# EAGLE design Klimasensor (EAGLE 7.3.0)
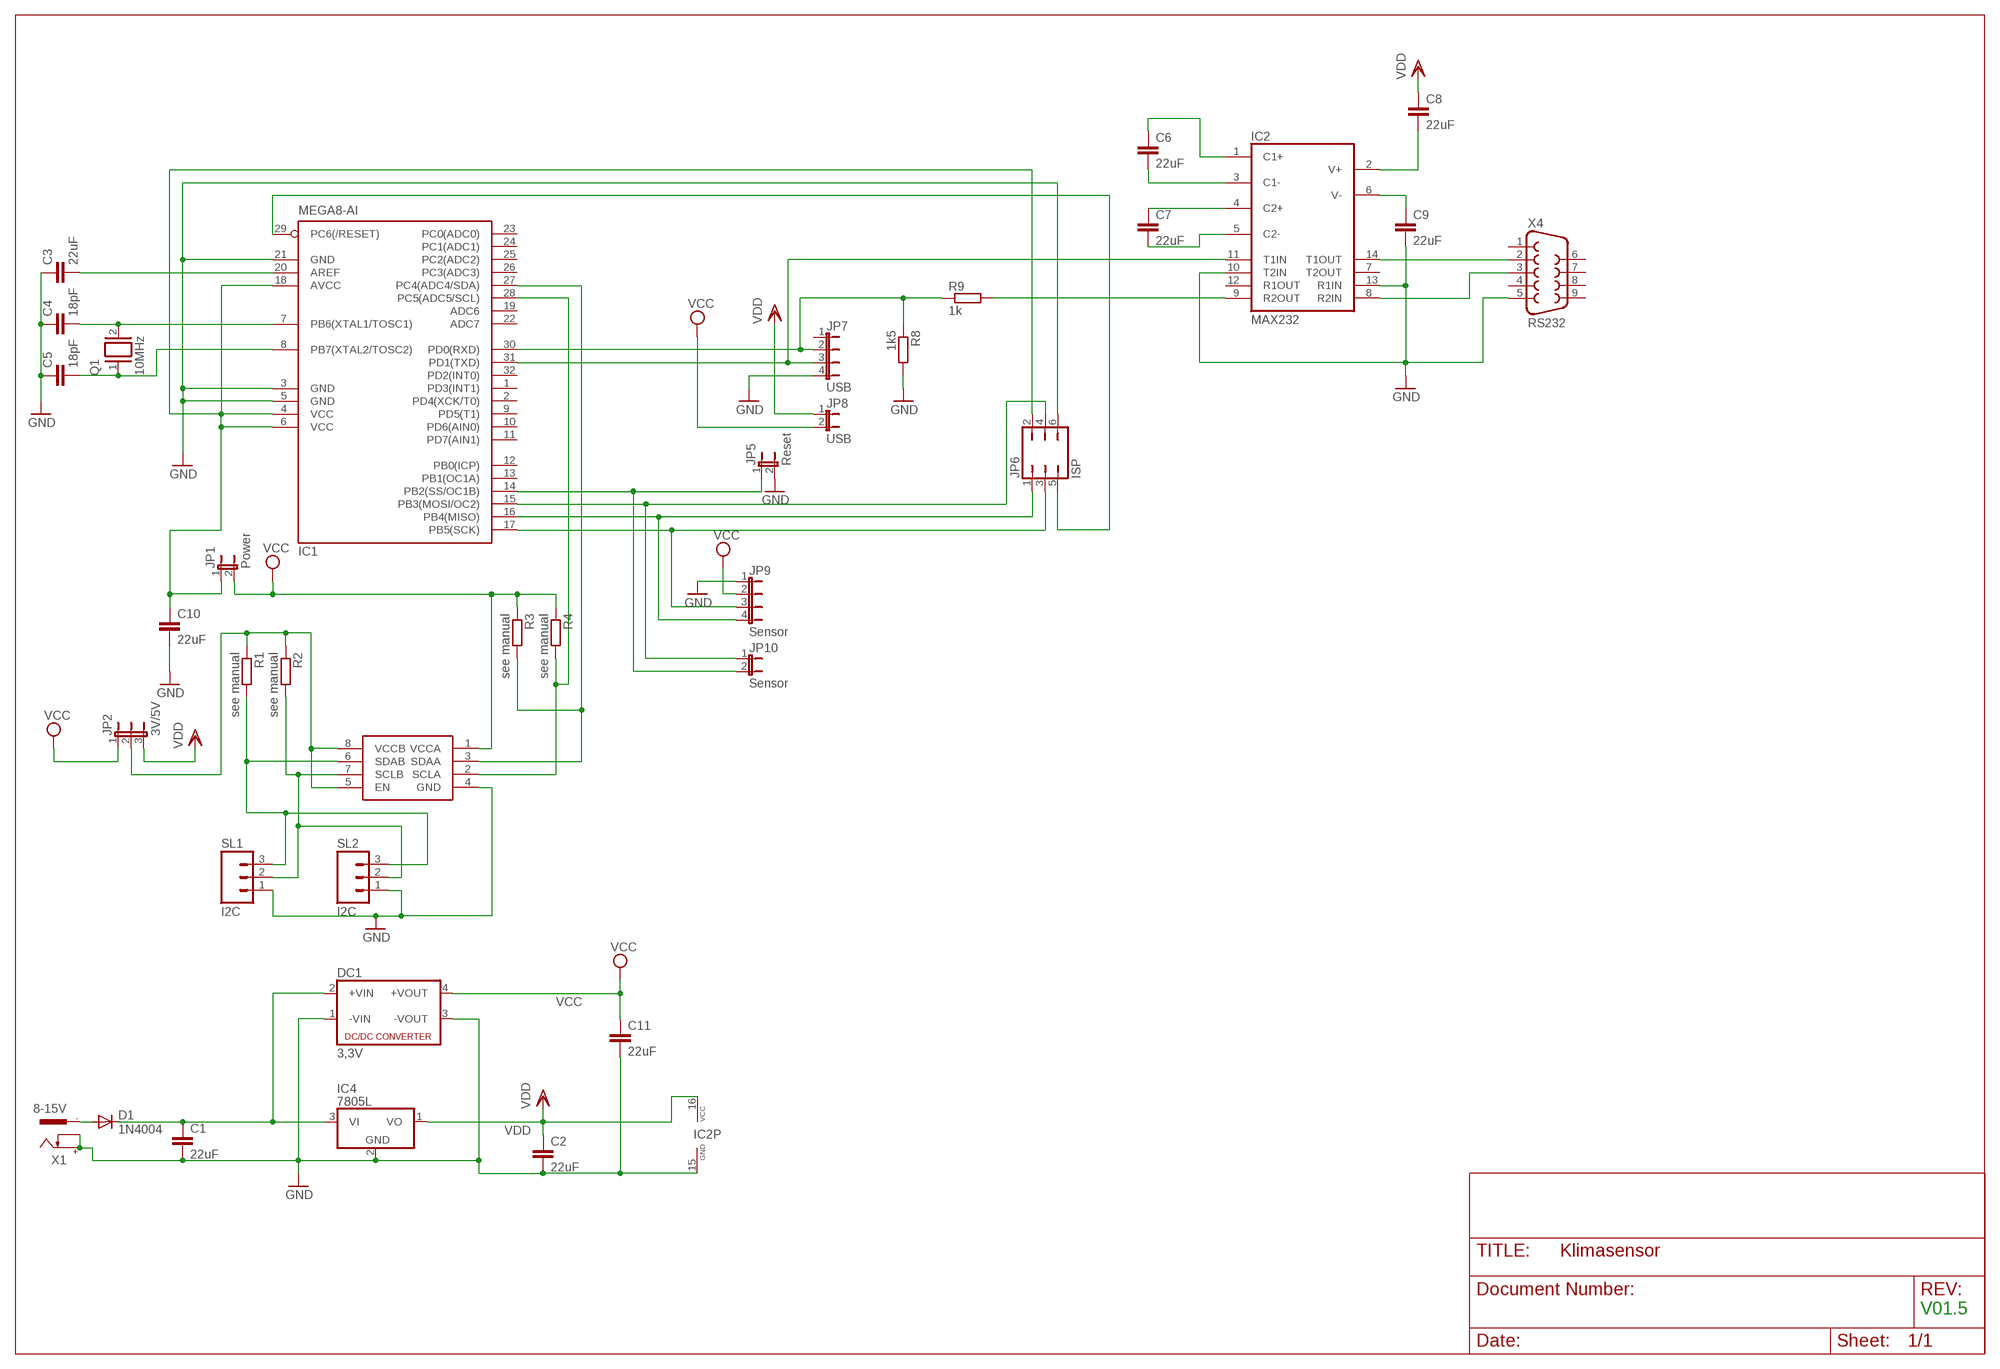
[diagram p0: schematic, sheet 1]

## Parts
C1  22uF  C-EUC1206  [C1206]
C2  22uF  C-EUC1206  [C1206]
C3  22uF  C-EUC1206  [C1206]
C4  18pF  C-EU025-025X050  [C025-025X050]
C5  18pF  C-EU025-025X050  [C025-025X050]
C6  22uF  C-EUC1206  [C1206]
C7  22uF  C-EUC1206  [C1206]
C8  22uF  C-EUC1206  [C1206]
C9  22uF  C-EUC1206  [C1206]
C10  22uF  C-EUC1206  [C1206]
C11  22uF  C-EUC1206  [C1206]
D1  1N4004  [DO41-10]
DC1  3,3V  NME  [NME]
IC1  MEGA8-AI  [TQFP32-08]
IC2  MAX232  [DIL16]
IC3  PCA9517  [SO-08]
IC4  7805L  [TO92]
JP1  Power  JP1E  [JP1]
JP2  3V/5V  JP2E  [JP2]
JP5  Reset  JP1E  [JP1]
JP6  ISP  JP3Q  [JP3Q]
JP7  USB  JP4E  [JP4]
JP8  USB  JP1E  [JP1]
JP9  Sensor  JP4E  [JP4]
JP10  Sensor  JP1E  [JP1]
Q1  10MHz  XTAL/S  [QS]
R1  see manual  R-EU_R1206  [R1206]
R2  see manual  R-EU_R1206  [R1206]
R3  see manual  R-EU_R1206  [R1206]
R4  see manual  R-EU_R1206  [R1206]
R8  1k5  R-EU_R1206  [R1206]
R9  1k  R-EU_R1206  [R1206]
SL1  I2C  M03  [03P]
SL2  I2C  M03  [03P]
X1  8-15V  737992-55  [737992-5]
X4  RS232  F09H  [F09H]

## Nets
GND: C1.2 C2.2 C3.1 C4.1 C5.1 C9.2 C10.2 C11.2 DC1.1(-VIN) DC1.3(-VOUT) IC1.3(GND) IC1.5(GND) IC1.21(GND) IC2.10(T2IN) IC2.13(R1IN) IC2.15(GND) IC3.4(GND) IC4.2(GND) JP5.2 JP6.6 JP7.4 JP9.1 R8.2 SL1.1 SL2.1 X1.+ X1.K X4.5
N$1: IC3.6(SDAB) R1.2 SL1.3 SL2.3
N$2: IC1.15(PB3(MOSI/OC2)) JP6.4 JP10.1
N$3: C1.1 D1.C DC1.2(+VIN) IC4.3(VI)
N$5: IC1.27(PC4(ADC4/SDA)) IC3.3(SDAA) R3.2
N$6: IC3.5(EN) IC3.8(VCCB) JP2.2 R1.1 R2.1
N$7: IC1.28(PC5(ADC5/SCL)) IC3.2(SCLA) R4.2
N$8: IC1.17(PB5(SCK)) JP6.3 JP9.3
N$10: IC1.31(PD1(TXD)) IC2.11(T1IN) JP7.3
N$11: IC1.14(PB2(SS/OC1B)) JP5.1 JP10.2
N$12: IC2.8(R2IN) X4.3
N$13: C3.2 IC1.20(AREF)
N$14: IC2.14(T1OUT) X4.2
N$15: IC1.16(PB4(MISO)) JP6.1 JP9.4
N$16: C8.2 IC2.2(V+)
N$17: C6.1 IC2.1(C1+)
N$18: IC1.29(PC6(/RESET)) JP6.5
N$19: C4.2 IC1.7(PB6(XTAL1/TOSC1)) Q1.2
N$20: C6.2 IC2.3(C1-)
N$21: C7.2 IC2.5(C2-)
N$22: IC3.7(SCLB) R2.2 SL1.2 SL2.2
N$23: C7.1 IC2.4(C2+)
N$24: C9.1 IC2.6(V-)
N$25: IC2.9(R2OUT) R9.2
N$26: C10.1 IC1.4(VCC) IC1.6(VCC) IC1.18(AVCC) JP1.1 JP6.2
N$27: D1.A X1.-1
N$28: IC1.30(PD0(RXD)) JP7.2 R8.1 R9.1
N$37: C5.2 IC1.8(PB7(XTAL2/TOSC2)) Q1.1
VCC: C11.1 DC1.4(+VOUT) IC3.1(VCCA) JP1.2 JP2.1 JP8.2 JP9.2 R3.1 R4.1
VDD: C2.1 C8.1 IC2.16(VCC) IC4.1(VO) JP2.3 JP8.1
Unconnected: IC1.1(PD3(INT1)) IC1.2(PD4(XCK/T0)) IC1.9(PD5(T1)) IC1.10(PD6(AIN0)) IC1.11(PD7(AIN1)) IC1.12(PB0(ICP)) IC1.13(PB1(OC1A)) IC1.19(ADC6) IC1.22(ADC7) IC1.23(PC0(ADC0)) IC1.24(PC1(ADC1)) IC1.25(PC2(ADC2)) IC1.26(PC3(ADC3)) IC1.32(PD2(INT0)) IC2.7(T2OUT) IC2.12(R1OUT) JP7.1 X1.-2 X4.1 X4.4 X4.6 X4.7 X4.8 X4.9

## Notes on the sheet
- V01.5

## Library data of the parts
C1-C3 C6-C11 = rcl:C-EU: CAPACITOR, European symbol
C4 C5 = resistor:C-EU: CAPACITOR, European symbol
D1 = diode:1N4004: DIODE general purpose rectifier, 1 A
DC1 = dc-dc-converter:NME: DC-DC CONVERTER; MF: C & D TECHNOLOGIES, INC; MPN: NME1205D; OC_FARNELL: 1021466; OC_NEWARK: 98B8198
IC1 = atmel:MEGA8: MICROCONTROLLER 8 Kbytes FLASH, 1 kbytes SRAM, 512 bytes EEPROM, USART, 6-channel 10 bit ADC, 2-channel 8 bit ADC Pin compatible with Atmega48, ATMega88, ATMega168 Source: avr.lbr; MPN: ATMEGA8-16AU; OC_FARNELL: 9171371; OC_NEWARK: 73M8863
IC2 = maxim:MAX232: RS232 TRANSCEIVER; MF: MAXIM; MPN: MAX232ACPE+; OC_FARNELL: 9723773; OC_NEWARK: 68K4544
IC3 = PCA9517:PCA9517
IC4 = linear:78*: Positive VOLTAGE REGULATOR Source: http://cache.national.com/ds/LM/LM78L05.pdf http://www.fairchildsemi.com/ds/LM/LM7805.pdf
JP1 JP5 JP8 JP10 = jumper:JP1E: JUMPER
JP2 = jumper:JP2E: JUMPER
JP6 = jumper:JP3Q: JUMPER
JP7 JP9 = jumper:JP4E: JUMPER
Q1 = special:XTAL/S: CRYSTAL
R1-R4 R8 R9 = resistor:R-EU_: RESISTOR, European symbol
SL1 SL2 = con-amp-quick:M03: AMP QUICK CONNECTOR; OC_FARNELL: unknown; OC_NEWARK: unknown
X1 = con-conrad:737992-55: FEMALE PRINT CONNECTOR DIN 45323 (34V/3A), ROKA, distributor Conrad
X4 = con-subd:F09: SUB-D; OC_FARNELL: unknown; OC_NEWARK: unknown

## Board
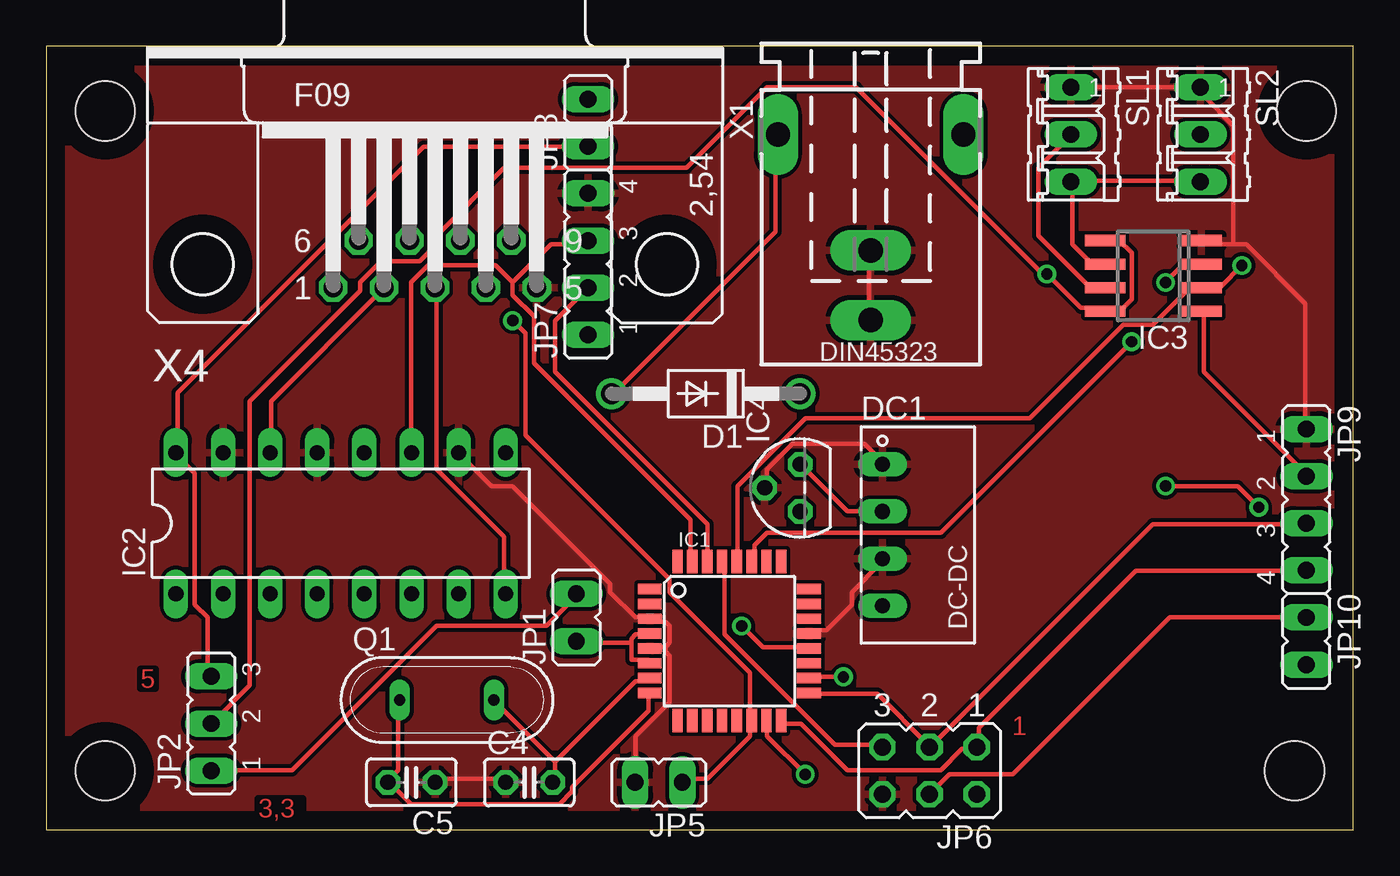
[diagram p1: board, top side]
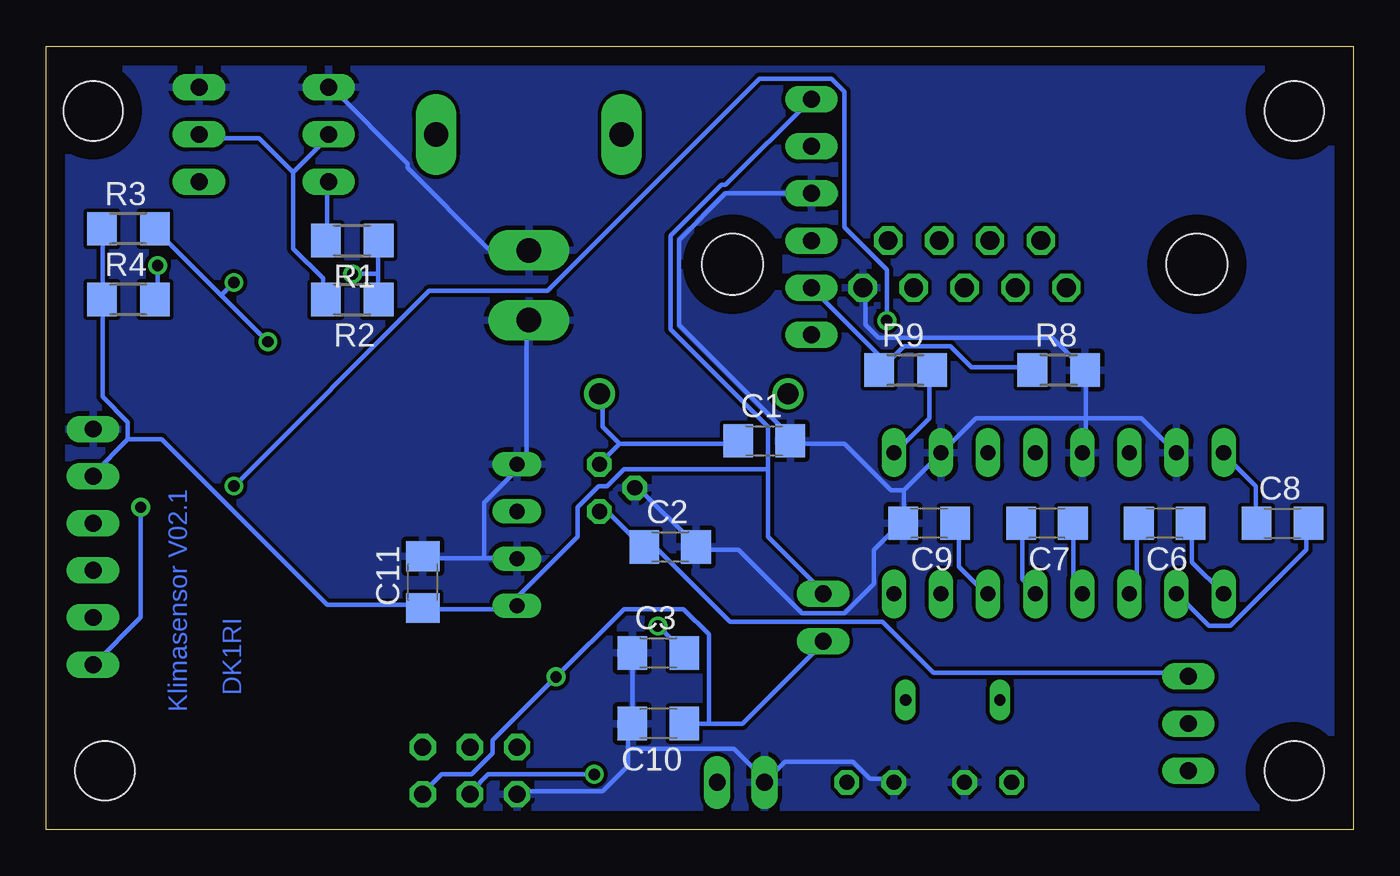
[diagram p2: board, bottom side, seen from below]

Size 70.47 x 42.22 mm. Coordinates in mm from the lower left corner, seen from the top.
Outline: 0,0 70.47,0 70.47,42.22 0,42.22 0,0
Copper layers (1*16): Top 0.035mm / dielectric 1.5mm / Bottom 0.035mm
Design rules "default": minimum track width 10mil, minimum drill 24mil, track to track 8mil, track to pad 8mil, pad to pad 8mil, via to via 8mil, smd to smd 8mil, copper to edge 40mil, drill to drill 8mil, minimum pad ring 10mil, minimum via ring 8mil, stop-mask expansion 4mil, vias tented up to drill 0mil, thermal gap 10mil
Holes 3.2 mm at 67.94,38.73 67.31,3.17 3.17,3.17 3.17,38.73

### Footprints (pad centres in the part's own frame; a part is rotated, then mirrored left to right if it is on the bottom)
C1206 = smd 1.6 x 1.8: 1 -1.4,0; 2 1.4,0
C025-025X050 = drill 0.813 octagon: 1 -1.27,0; 2 1.27,0
DO41-10 = drill 1.118: A 5.08,0; C -5.08,0
NME = drill 0.813 long: 1 0,3.81; 2 0,1.27; 3 0,-1.27; 4 0,-3.81
TQFP32-08 = smd 1.27 x 0.559: 1 -4.293,2.8; 2 -4.293,2; 3 -4.293,1.2; 4 -4.293,0.4; 5 -4.293,-0.4; 6 -4.293,-1.2; 7 -4.293,-2; 8 -4.293,-2.8; 17 4.293,-2.8; 18 4.293,-2; 19 4.293,-1.2; 20 4.293,-0.4; 21 4.293,0.4; 22 4.293,1.2; 23 4.293,2; 24 4.293,2.8 | smd 0.559 x 1.27: 9 -2.8,-4.293; 10 -2,-4.293; 11 -1.2,-4.293; 12 -0.4,-4.293; 13 0.4,-4.293; 14 1.2,-4.293; 15 2,-4.293; 16 2.8,-4.293; 25 2.8,4.293; 26 2,4.293; 27 1.2,4.293; 28 0.4,4.293; 29 -0.4,4.293; 30 -1.2,4.293; 31 -2,4.293; 32 -2.8,4.293
DIL16 = drill 0.813 long: 1 -8.89,-3.81; 2 -6.35,-3.81; 3 -3.81,-3.81; 4 -1.27,-3.81; 5 1.27,-3.81; 6 3.81,-3.81; 7 6.35,-3.81; 8 8.89,-3.81; 9 8.89,3.81; 10 6.35,3.81; 11 3.81,3.81; 12 1.27,3.81; 13 -1.27,3.81; 14 -3.81,3.81; 15 -6.35,3.81; 16 -8.89,3.81
SO-08 = smd 0.6 x 2.2: 1 -1.905,-2.6; 2 -0.635,-2.6; 3 0.635,-2.6; 4 1.905,-2.6; 5 1.905,2.6; 6 0.635,2.6; 7 -0.635,2.6; 8 -1.905,2.6
TO92 = drill 0.813 octagon: 1 -1.27,0; 2 0,1.905; 3 1.27,0
JP1 = drill 0.914 long: 1 0,-1.27; 2 0,1.27
JP2 = drill 0.914 long: 1 -2.54,0; 2 0,0; 3 2.54,0
JP3Q = drill 0.914 octagon: 1 -2.54,-1.27; 2 -2.54,1.27; 3 0,-1.27; 4 0,1.27; 5 2.54,-1.27; 6 2.54,1.27
JP4 = drill 0.914 long: 1 -3.81,0; 2 -1.27,0; 3 1.27,0; 4 3.81,0
QS = drill 0.61 long: 1 -2.54,0; 2 2.54,0
R1206 = smd 1.6 x 1.803: 1 -1.422,0; 2 1.422,0
03P = drill 0.914 long: 1 -2.54,0; 2 0,0; 3 2.54,0
737992-5 = drill 1.3 pad 2.184 long: + 0,10; -1 5,0; -2 -5,0; K 0,6.25
F09H = drill 1.016 octagon: 1 -5.486,-1.27; 2 -2.743,-1.27; 3 0,-1.27; 4 2.743,-1.27; 5 5.486,-1.27; 6 -4.115,1.27; 7 -1.372,1.27; 8 1.372,1.27; 9 4.115,1.27 | hole 3.302: -12.522,0; 12.522,0

### Placement (x,y rotation side)
C1  31.75,20.95 0 bottom
C2  36.83,15.24 0 bottom
C3  37.47,9.53 0 bottom
C4  26.04,2.54 0 top
C5  19.68,2.54 180 top
C6  10.16,16.51 180 bottom
C7  16.51,16.51 180 bottom
C8  3.81,16.51 0 bottom
C9  22.86,16.51 180 bottom
C10  37.47,5.71 180 bottom
C11  50.16,13.34 90 bottom
D1  35.56,23.5 180 top
DC1  45.09,15.88 0 top
IC1  36.83,10.16 0 top
IC2  15.88,16.51 0 top
IC3  59.69,29.84 90 top
IC4  40.64,18.41 90 top
JP1  28.57,11.43 0 top
JP2  8.89,5.71 90 top
JP5  33.02,2.54 90 top
JP6  47.62,3.17 180 top
JP7  29.21,30.48 90 top
JP8  29.21,38.1 0 top
JP9  67.94,17.78 270 top
JP10  67.94,10.16 180 top
Q1  21.59,6.99 0 top
R1  53.98,31.75 180 bottom
R2  53.98,28.57 180 bottom
R3  66.04,32.38 0 bottom
R4  66.04,28.57 0 bottom
R8  15.88,24.77 0 bottom
R9  24.13,24.77 0 bottom
SL1  55.24,37.47 270 top
SL2  62.23,37.47 270 top
X1  44.45,37.47 180 top
X4  20.95,30.48 0 top

### Tracks (layer width: path | path; a pad name or v marks a point on that pad's centre or on a via)
GND
  Top 0.254: SL1.1 SL2.1 62.41,40.01 62.41,39.55 64.01,37.95 64.01,31.55 | 62.23,31.77 62.18,31.77 IC3.4 62.41,31.55 64.01,31.55 | 64.01,31.55 64.69,31.55 67.89,28.35 67.89,21.72 JP9.1 | X1.+ 44.35,27.66 44.35,31.09 X1.K | IC1.21 41.15,10.74 42.06,10.74 43.43,12.12 43.43,12.8 45.03,14.4 DC1.3 | IC4.2 38.86,18.52 38.86,19.43 40.23,20.8 44.12,20.8 45.03,19.89 DC1.1 | C5.1 21.03,2.74 24.69,2.74 C4.1 | 33.38,9.83 32.69,9.83 IC1.5 | 33.38,9.83 33.6,10.06 33.6,10.97 33.38,11.2 32.69,11.2 IC1.3 32.46,11.43 31.77,11.43 30.4,12.8 30.4,13.26 25.15,18.52 24,18.52 22.4,20.12 IC2.10 | 33.38,9.83 33.38,9.6 33.6,9.37 33.6,6.86 31.77,5.03 31.77,2.74 JP5.2
  Bottom 0.254: IC4.2 38.63,18.52 35.43,15.32 C2.2 35.2,15.09 33.15,15.09 29.72,11.66 27.43,11.66 25.83,13.26 25.83,15.09 24.46,16.46 C9.2 24.23,16.69 24.23,18.29 | 46.86,14.63 45.26,14.63 DC1.3 | 46.86,14.63 50.06,14.63 C11.2 | 46.86,14.63 46.86,17.6 45.26,19.2 45.26,19.66 DC1.1 45.03,19.89 44.58,20.34 44.58,27.43 X1.+ | SL1.1 55.09,40.01 50.98,35.89 50.98,35.66 46.63,31.32 44.58,31.32 X1.K | C3.1 38.86,9.37 C10.2 39.09,5.71 39.09,4.34 | 39.09,4.34 39.09,3.43 40.46,2.06 45.03,2.06 JP6.6 | C4.1 24.92,2.74 26.06,2.74 26.98,3.66 30.63,3.66 JP5.2 31.77,2.74 33.38,4.34 39.09,4.34 | 14.4,22.17 14.4,20.34 IC2.13 | 14.4,22.17 14.4,24.69 R8.2 14.63,24.92 16.23,26.52 25.6,26.52 26.29,27.2 26.29,29.03 X4.5 | 14.4,22.17 11.43,22.17 9.6,20.34 IC2.15 | 24.23,18.29 22.4,20.12 IC2.10 22.17,20.34 20.34,22.17 14.4,22.17 | 24.23,18.29 24.92,18.29 27.43,20.8 30.18,20.8 C1.2 30.18,21.03 36.35,27.2 36.35,31.77 33.83,34.29 JP7.4
  pour Top: 0.64,41.27 69.85,41.27 69.85,0.64 0.64,0.64
  pour Bottom: 0.64,41.27 69.85,41.27 69.85,0.64 0.64,0.64
N$1
  Top 0.254: IC3.6 56.92,30.63 56.24,30.63 55.32,31.55 55.32,34.75 SL1.3 55.32,34.98 62.18,34.98 SL2.3
  Bottom 0.254: R1.2 55.32,31.77 55.32,34.75 SL1.3
N$2  (via drill 0.61)
  Top 0.254: v40.92,2.97 38.86,5.03 38.86,5.71 IC1.15 | JP10.1 60.58,11.43 52.12,2.97 48.69,2.97 JP6.4
  Bottom 0.254: v40.92,2.97 46.63,2.97 47.55,2.06 JP6.4
N$3
  Top 0.254: DC1.2 43.2,17.14 40.69,19.66 IC4.3
  Bottom 0.254: 39.55,20.8 33.38,20.8 C1.1 | 39.55,20.8 40.46,19.89 IC4.3 | 39.55,20.8 40.46,21.72 40.46,23.32 D1.C
N$5  (via drill 0.61)
  Top 0.254: v58.52,26.29 48.23,16 38.86,16 38.18,15.32 38.18,14.63 IC1.27 | v60.35,29.49 61.27,30.4 62.18,30.4 IC3.3
  Bottom 0.254: 61.04,28.8 64.47,32.23 R3.2 | 61.04,28.8 v58.52,26.29 | 61.04,28.8 v60.35,29.49
N$6  (via drill 0.61)
  Top 0.254: JP2.2 8.91,5.71 10.97,7.77 10.97,23.09 16.92,29.03 16.92,29.49 18.06,30.63 20.12,30.63 21.03,31.55 21.03,32 24.69,35.66 34.52,35.66 38.86,40.01 43.66,40.01 53.72,29.95 v53.95,29.95 55.78,28.12 56.92,28.12 IC3.8 57.15,28.12 58.06,28.12 58.52,28.57 58.52,31.09 57.84,31.77 IC3.5
  Top 0.406: IC3.5 57.78,31.75
  Bottom 0.254: 52.58,29.95 52.58,31.55 R1.1 | 52.58,29.95 52.58,28.57 R2.1 | 52.58,29.95 v53.95,29.95
N$7  (via drill 0.61)
  Top 0.254: IC1.28 37.26,14.63 37.26,18.52 40.92,22.17 53.03,22.17 58.06,27.2 59.66,27.2 61.49,29.03 62.18,29.03 IC3.2 62.41,29.26 63.32,29.26 v64.47,30.4
  Bottom 0.254: v64.47,30.4 64.47,28.57 R4.2
N$8
  Top 0.254: IC1.17 41.15,7.32 44.81,7.32 47.55,4.57 JP6.3 47.78,4.57 59.66,16.46 67.89,16.46 JP9.3
N$10
  Top 0.254: 25.15,29.49 25.15,28.8 26.29,27.66 26.29,25.15 34.75,16.69 34.75,14.63 IC1.31 | 25.15,29.49 27.2,31.55 29.03,31.55 JP7.3 | 25.15,29.49 24.23,30.4 20.57,30.4 19.66,29.49 19.66,20.34 IC2.11
N$11  (via drill 0.61)
  Top 0.254: v25.15,27.43 25.83,26.75 25.83,21.26 33.6,13.49 33.6,12.8 37.95,8.46 37.95,5.94 IC1.14 37.95,5.71 37.95,5.03 35.66,2.74 34.29,2.74 JP5.1 | v60.35,18.52 64.24,18.52 v65.38,17.37
  Bottom 0.254: v25.15,27.43 25.15,30.18 27.43,32.46 27.43,39.78 28.12,40.46 32,40.46 43.43,29.03 49.84,29.03 v60.35,18.52 | v65.38,17.37 65.38,11.43 67.89,8.91 JP10.2
N$12
  Top 0.254: IC2.8 24.69,12.8 24.69,15.77 21.03,19.43 21.03,29.03 X4.3
N$13  (via drill 0.61)
  Top 0.254: v37.49,10.97 38.63,9.83 40.92,9.83 IC1.20
  Bottom 0.254: v37.49,10.97 36.12,9.6 C3.2
N$14
  Top 0.254: IC2.14 12.12,20.34 12.12,23.09 18.06,29.03 X4.2
N$15
  Top 0.254: IC1.16 39.78,5.71 40.69,5.71 43.2,3.2 48.23,3.2 49.38,4.34 50.06,4.34 JP6.1 50.29,4.57 50.29,5.49 58.75,13.95 67.89,13.95 JP9.4
N$16
  Bottom 0.254: C8.2 2.52,16.46 2.52,15.09 6.63,10.97 7.77,10.97 9.37,12.57 IC2.2
N$17
  Bottom 0.254: IC2.1 8.69,14.4 8.69,16.46 C6.1
N$18
  Top 0.254: IC1.29 36.58,14.4 36.58,10.52 42.52,4.57 45.03,4.57 JP6.5
N$19
  Top 0.254: 27.43,3.66 31.77,8 32.46,8 IC1.7 | 27.43,3.66 27.43,2.74 C4.2 | 27.43,3.66 24.23,6.86 Q1.2
N$20
  Bottom 0.254: C6.2 11.66,16.46 11.66,13.03 11.89,12.8 IC2.3
N$21
  Bottom 0.254: C7.2 17.83,16.46 17.83,13.49 17.14,12.8 IC2.5
N$22
  Top 0.254: IC3.7 56.92,29.26 56.24,29.26 53.49,32 53.49,35.66 55.09,37.26 SL1.2
  Bottom 0.254: 57.15,35.43 57.15,31.32 55.55,29.72 55.55,28.57 R2.2 | 57.15,35.43 55.32,37.26 SL1.2 | 57.15,35.43 58.98,37.26 62.18,37.26 SL2.2
N$23
  Bottom 0.254: C7.1 15.09,16.46 15.09,13.26 14.63,12.8 IC2.4
N$24
  Bottom 0.254: C9.1 21.26,16.46 21.26,14.17 19.89,12.8 IC2.6
N$25
  Bottom 0.254: R9.2 22.86,24.69 22.86,22.17 24.69,20.34 IC2.9
N$26  (via drill 0.61)
  Top 0.254: 31.55,10.06 31.55,10.29 31.77,10.52 32.46,10.52 IC1.4 | 31.55,10.06 31.55,9.14 32.46,9.14 IC1.6 | 31.55,10.06 28.57,10.06 JP1.1 | v42.98,8.23 41.15,8.23 IC1.18
  Bottom 0.254: 34.75,5.71 32.92,5.71 28.57,10.06 JP1.1 | 34.75,5.71 C10.1 | JP6.2 50.06,2.06 49.15,2.97 47.55,2.97 46.41,4.12 46.41,4.8 v42.98,8.23 39.32,11.89 36.12,11.89 34.75,10.52 34.75,5.71
N$27
  Top 0.254: D1.A 30.63,23.55 39.32,32.23 39.32,37.26 X1.-1
N$28
  Top 0.254: JP7.2 27.43,27.43 27.43,24.69 35.66,16.46 35.66,14.63 IC1.30
  Bottom 0.254: 25.15,25.15 25.38,24.92 R9.1 25.15,25.15 | 25.15,25.15 24.23,26.06 21.72,26.06 20.57,24.92 17.37,24.92 R8.1 | JP7.2 25.15,25.15
N$37
  Top 0.254: IC1.8 32.46,7.32 32.46,6.4 28.35,2.29 28.35,2.06 27.66,1.37 19.66,1.37 18.52,2.52 C5.2 18.52,2.74 18.97,3.2 18.97,6.86 Q1.1
VCC
  Top 0.254: IC3.1 62.41,27.89 62.41,24.69 67.89,19.2 JP9.2 | JP2.1 8.91,3.2 13.26,3.2 21.03,10.97 26.98,10.97 28.57,12.57 JP1.2
  Bottom 0.254: 67.44,28.57 67.44,32.23 R3.1 | 67.44,28.57 67.44,23.32 66.06,21.95 66.06,21.03 | 66.06,21.03 67.89,19.2 JP9.2 | 67.44,28.57 R4.1 | JP8.2 33.83,34.75 34.06,34.75 36.8,32 36.8,26.98 31.55,21.72 31.55,19.43 | 31.55,19.43 31.55,15.77 28.57,12.8 JP1.2 | 31.55,19.43 39.32,19.43 40.23,18.52 40.69,18.52 41.83,17.37 41.83,15.77 45.03,12.57 45.03,12.12 DC1.4 45.26,11.89 50.06,11.89 C11.1 50.29,12.12 55.32,12.12 64.24,21.03 66.06,21.03
VDD
  Top 0.254: JP2.3 8.69,8.46 8.69,11.43 8,12.12 8,19.2 7.09,20.12 IC2.16 7.09,20.34 7.09,23.55 20.34,36.8 29.03,36.8 JP8.1
  Bottom 0.254: IC4.1 40.23,17.14 38.41,15.32 C2.1 38.18,15.09 37.49,15.09 33.6,11.2 25.38,11.2 22.63,8.46 8.91,8.46 JP2.3 | C8.1 5.26,16.69 5.26,18.52 6.86,20.12 IC2.16

### Text on the board
Top: 5 | 1 | 3,3
Bottom: DK1RI | Klimasensor V02.1